# EAGLE design IdcProbe (EAGLE 7.1.0)

## Sheet 1 of 2: Power
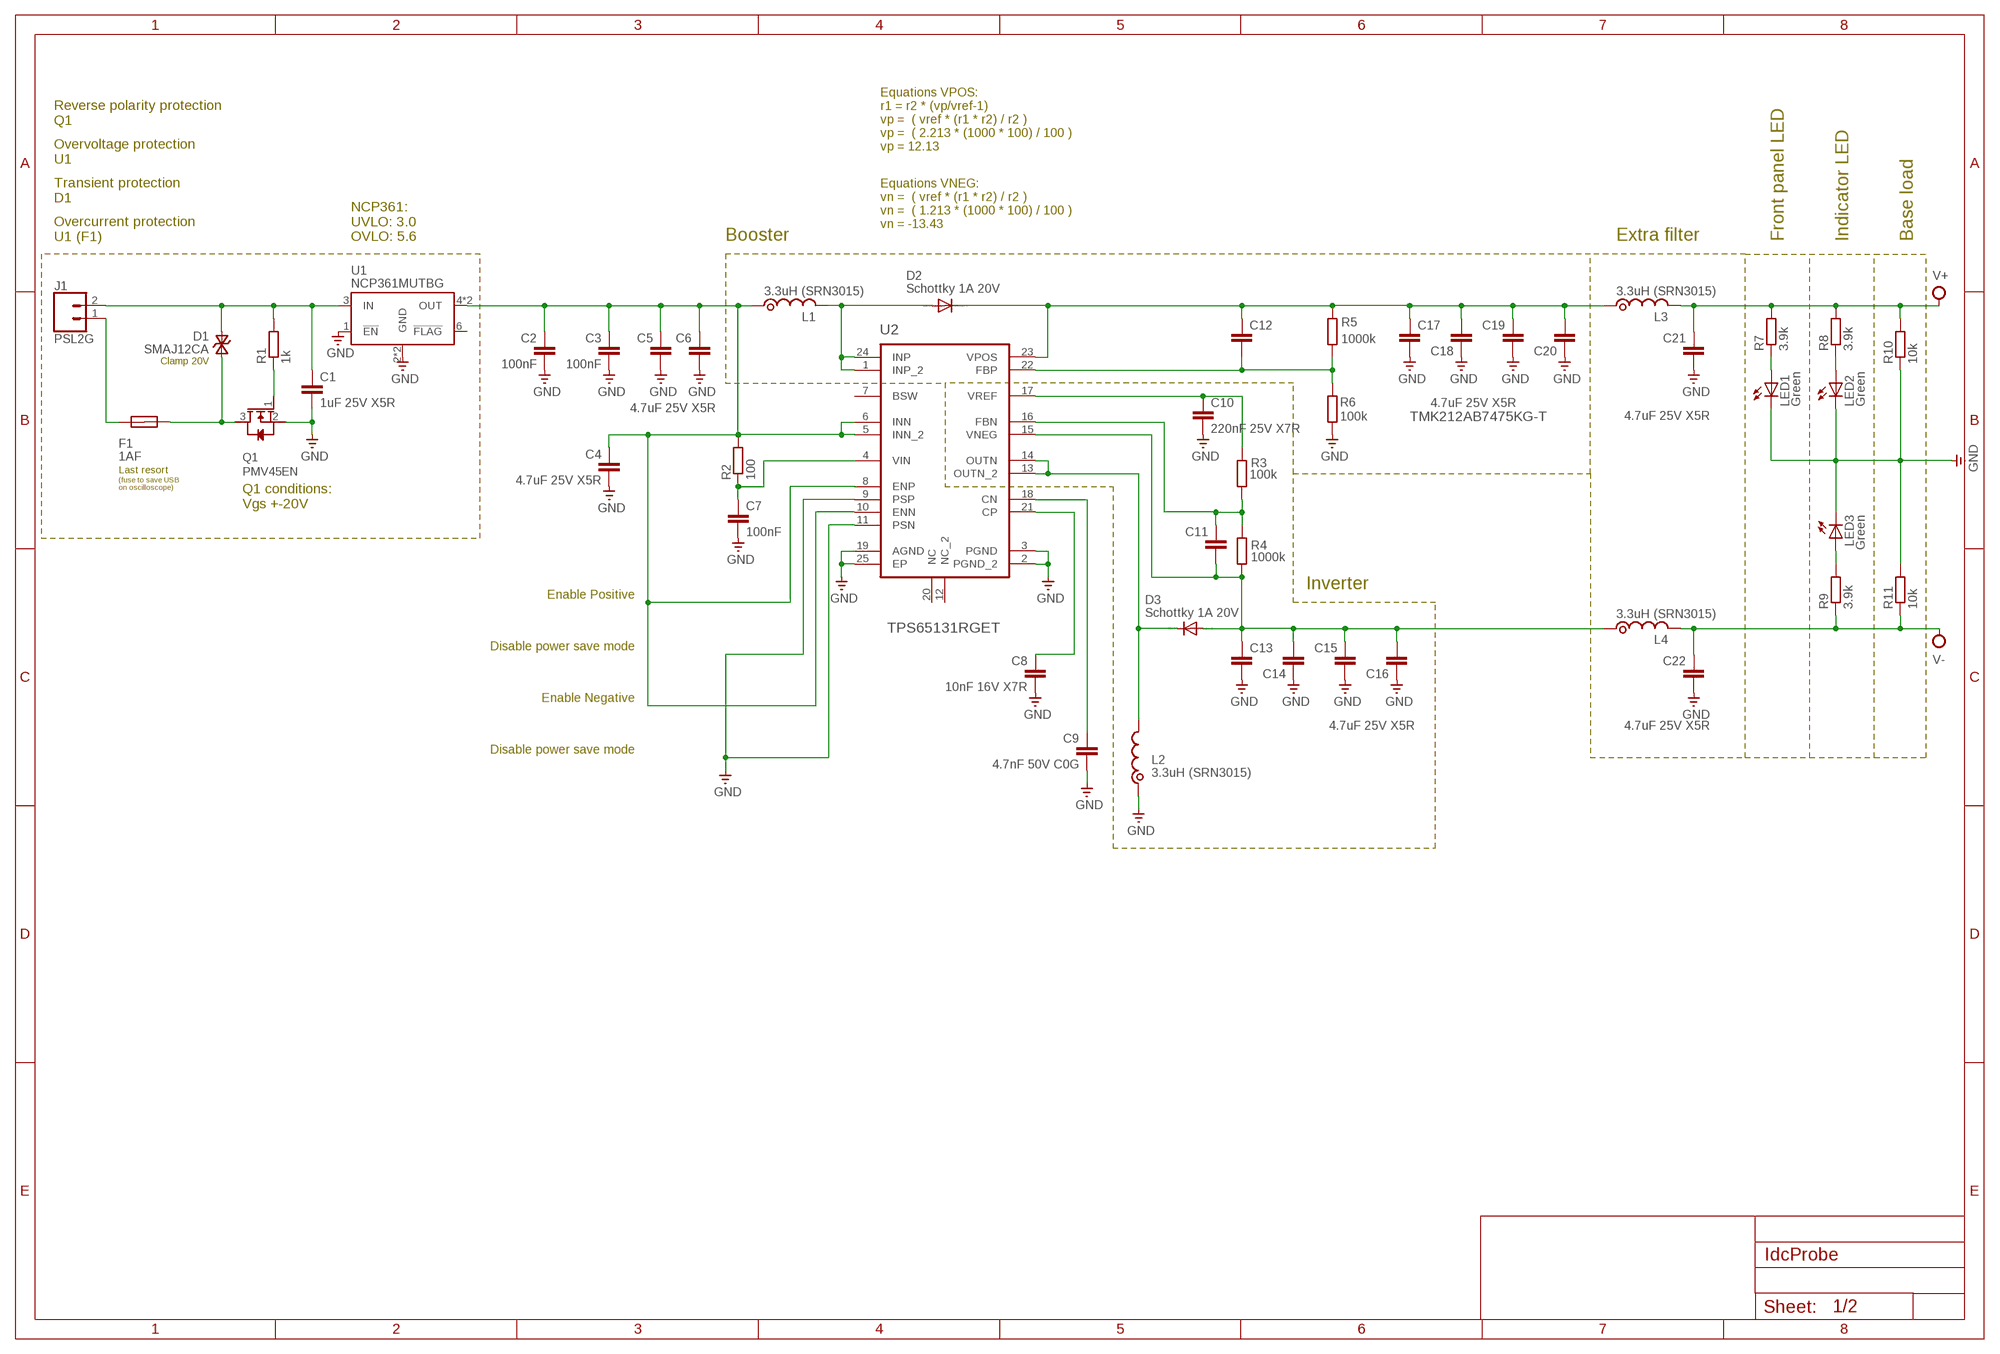
[diagram p0: schematic, sheet 1]

### Parts
C1  1uF 25V X5R  C-EUC0805  [C0805]
C2  100nF  C-EUC0805  [C0805]
C3  100nF  C-EUC0805  [C0805]
C4  4.7uF 25V X5R  C-EUC0805  [C0805]
C5  4.7uF 25V X5R  C-EUC0805  [C0805]
C6  4.7uF 25V X5R  C-EUC0805  [C0805]
C7  100nF  C-EUC0805  [C0805]
C8  10nF 16V X7R  C-EUC0805  [C0805]
C9  4.7nF 50V C0G  C-EUC0805  [C0805]
C10  220nF 25V X7R  C-EUC0805  [C0805]
C11  C-EUC0805  [C0805]
C12  C-EUC0805  [C0805]
C13  4.7uF 25V X5R  C-EUC0805  [C0805]
C14  4.7uF 25V X5R  C-EUC0805  [C0805]
C15  4.7uF 25V X5R  C-EUC0805  [C0805]
C16  4.7uF 25V X5R  C-EUC0805  [C0805]
C17  4.7uF 25V X5R  C-EUC0805  [C0805]
C18  4.7uF 25V X5R  C-EUC0805  [C0805]
C19  4.7uF 25V X5R  C-EUC0805  [C0805]
C20  4.7uF 25V X5R  C-EUC0805  [C0805]
C21  4.7uF 25V X5R  C-EUC0805  [C0805]
C22  4.7uF 25V X5R  C-EUC0805  [C0805]
D1  SMAJ12CA  TVS_BISMA  [SMA_NOPOL]
D2  Schottky 1A 20V  DIODE-SOD323-R  [SOD323-R]
D3  Schottky 1A 20V  DIODE-SOD323-R  [SOD323-R]
F1  1AF  FUSE1206  [1206_HV]
J1  PSL2G  CONN_02POLAR  [MOLEX-1X2]
L1  3.3uH (SRN3015)  INDUCTOR_VLS3015  [VLS3015]
L2  3.3uH (SRN3015)  INDUCTOR_VLS3015  [VLS3015]
L3  3.3uH (SRN3015)  INDUCTOR_VLS3015  [VLS3015]
L4  3.3uH (SRN3015)  INDUCTOR_VLS3015  [VLS3015]
LED1  Green  LED3MM  [LED3MM]
LED2  Green  LEDCHIP-LED0805  [CHIP-LED0805]
LED3  Green  LEDCHIP-LED0805  [CHIP-LED0805]
Q1  PMV45EN  [SOT23]
R1  1k  R-EU_R0805I  [R0805I]
R2  100  R-EU_R0805I  [R0805I]
R3  100k  R-EU_R0805I  [R0805I]
R4  1000k  R-EU_R0805I  [R0805I]
R5  1000k  R-EU_R0805I  [R0805I]
R6  100k  R-EU_R0805I  [R0805I]
R7  3.9k  R-EU_R0805I  [R0805I]
R8  3.9k  R-EU_R0805I  [R0805I]
R9  3.9k  R-EU_R0805I  [R0805I]
R10  10k  R-EU_R0805I  [R0805I]
R11  10k  R-EU_R0805I  [R0805I]
U1  NCP361MUTBG  NCP36XMU  [UDFN6_2X2]
U2  TPS65131RGET  [QFN50P400X400X100-25N]

### Nets
CN: C9.1 U2.18(CN)
CP: C8.1 U2.21(CP)
FBN: C11.1 R3.1 R4.1 U2.16(FBN)
FBP: C12.2 R5.1 R6.2 U2.22(FBP)
GND: C1.2 C2.2 C3.2 C4.2 C5.2 C6.2 C7.2 C8.2 C9.2 C10.2 C13.2 C14.2 C15.2 C16.2 C17.2 C18.2 C19.2 C20.2 C21.2 C22.2 L2.1 LED1.K(C) LED2.C LED3.C Q1.2(S) R6.1 R10.1 R11.2 U1.1(!EN) U1.2(GND) U1.7(GND) U2.2(PGND_2) U2.3(PGND) U2.9(PSP) U2.11(PSN) U2.19(AGND) U2.25(EP) ; also sheet 2
INP: D2.A L1.2 U2.1(INP_2) U2.24(INP)
N$1: LED2.A R8.1
N$2: LED3.A R9.2
N$16: LED1.A R7.1
N$17: C1.1 D1.2(C) J1.2 R1.2 U1.3(IN)
N$18: D1.1(A) F1.P$1 Q1.3(D)
N$19: Q1.1(G) R1.1
N$21: F1.P$2 J1.1
OUTN: D3.C L2.2 U2.13(OUTN_2) U2.14(OUTN)
RV+: C12.1 C17.1 C18.1 C19.1 C20.1 D2.C L3.1 R5.2 U2.23(VPOS)
RV-: C11.2 C13.1 C14.1 C15.1 C16.1 D3.A L4.1 R4.2 U2.15(VNEG)
V+: C21.1 L3.2 R7.2 R8.2 R10.2 ; also sheet 2
V-: C22.1 L4.2 R9.1 R11.1 ; also sheet 2
VI: C2.1 C3.1 C4.1 C5.1 C6.1 L1.1 R2.2 U1.4(OUT) U1.5(OUT) U2.5(INN_2) U2.6(INN) U2.8(ENP) U2.10(ENN)
VIN: C7.1 R2.1 U2.4(VIN)
VREF: C10.1 R3.2 U2.17(VREF)
Unconnected: U1.6(!FLAG) U2.7(BSW) U2.12(NC_2) U2.20(NC)

### Notes on the sheet
- Reverse polarity protection
  Q1
- Equations VPOS:
  r1 = r2 * (vp/vref-1)
  vp =  ( vref * (r1 * r2) / r2 )
  vp =  ( 2.213 * (1000 * 100) / 100 )
  vp = 12.13
- Overvoltage protection
  U1
- Transient protection
  D1
- Equations VNEG:
  vn =  ( vref * (r1 * r2) / r2 )
  vn =  ( 1.213 * (1000 * 100) / 100 )
  vn = -13.43
- Overcurrent protection
  U1 (F1)
- NCP361:
  UVLO: 3.0
  OVLO: 5.6
- Booster | Extra filter | Front panel LED | Indicator LED | Base load
- Clamp 20V
- Last resort
- (fuse to save USB 
  on oscilloscope)
- Q1 conditions:
  Vgs +-20V
- Enable Positive | Inverter
- Disable power save mode
- Enable Negative
- Disable power save mode

## Sheet 2 of 2: Measurement
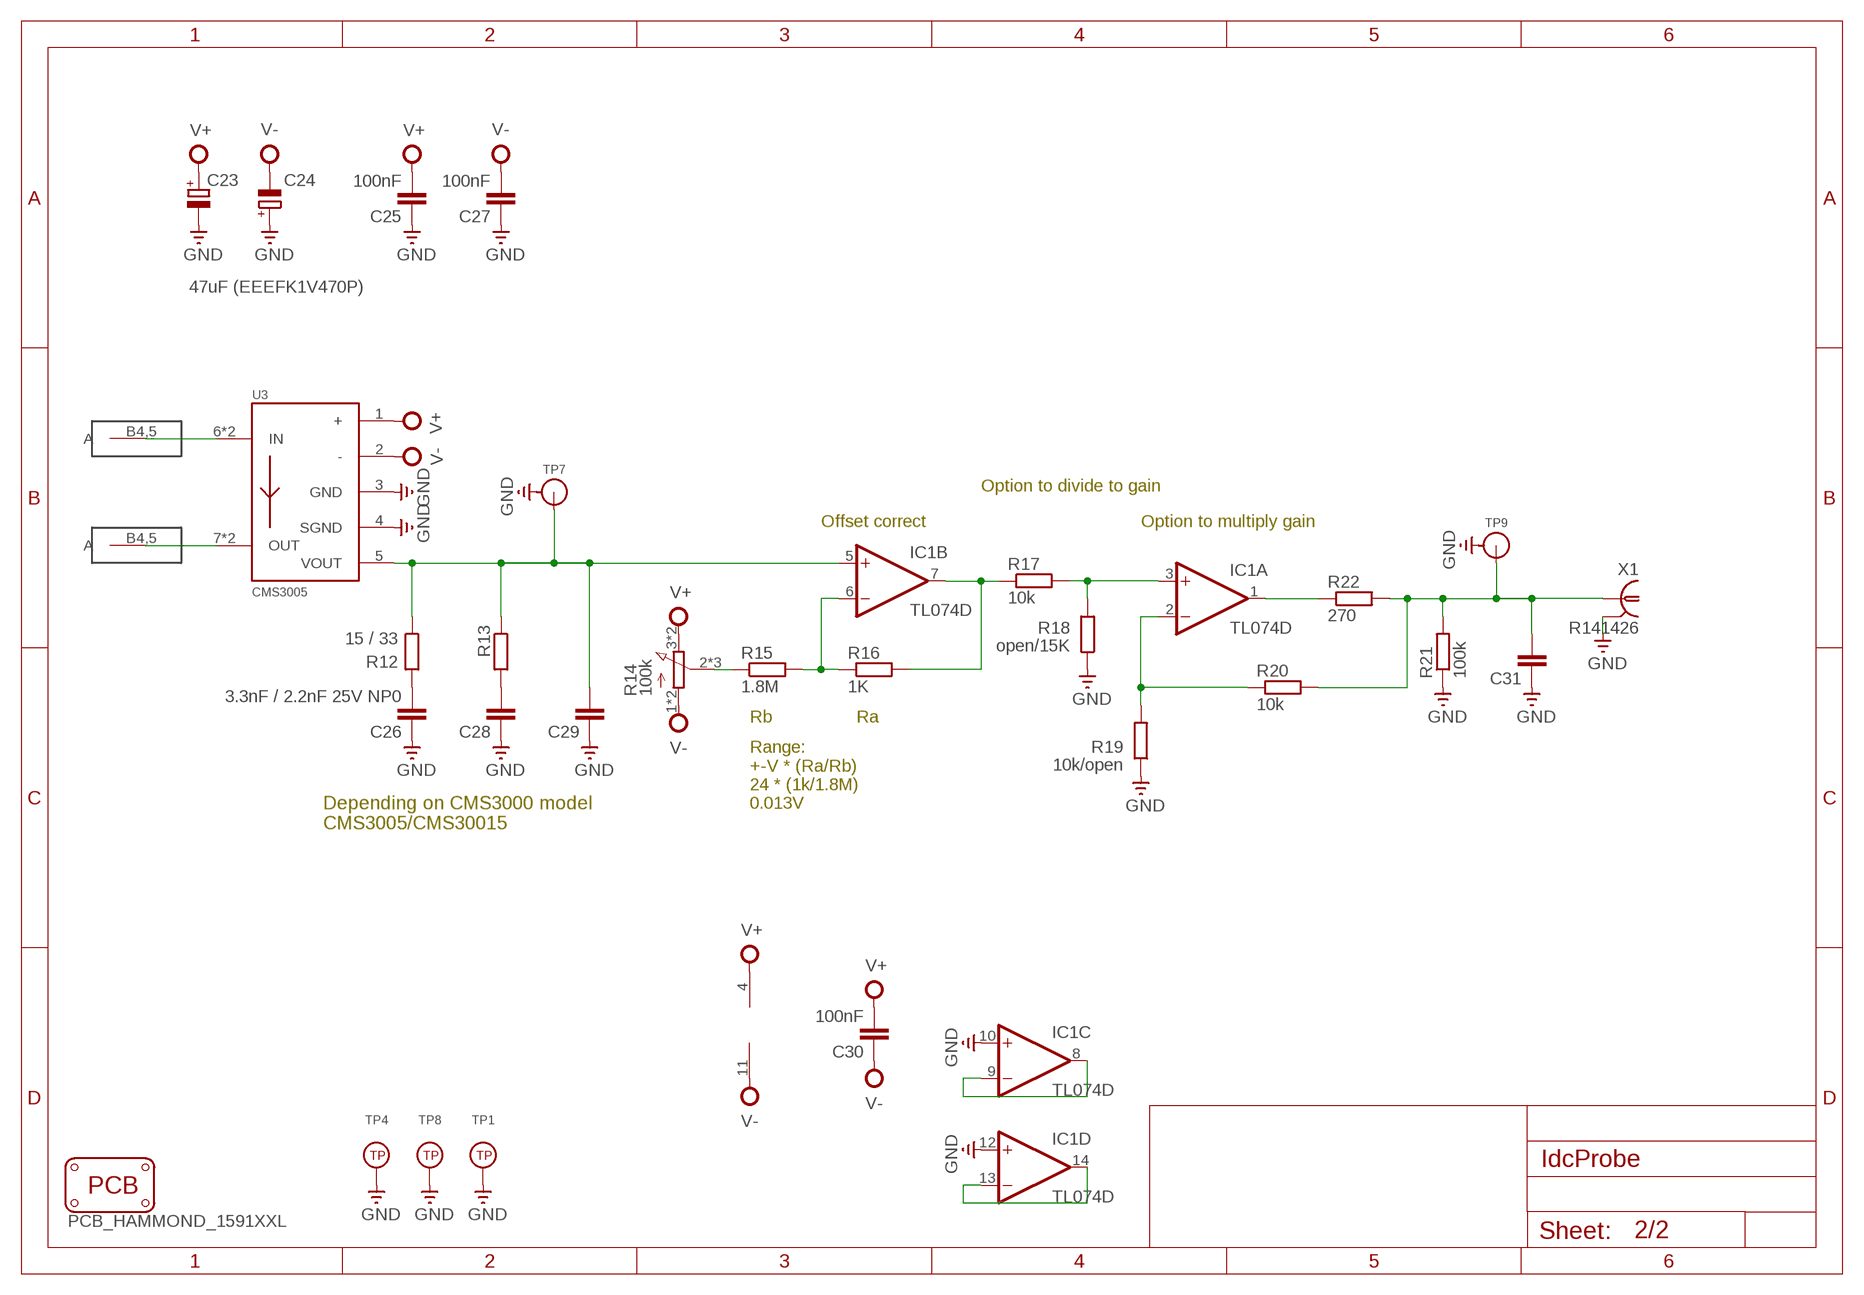
[diagram p1: schematic, sheet 2]

### Parts
C23  47uF (EEEFK1V470P)  CPOL-EUD  [PANASONIC_D]
C24  47uF (EEEFK1V470P)  CPOL-EUD  [PANASONIC_D]
C25  100nF  C-EUC0805  [C0805]
C26  3.3nF / 2.2nF 25V NP0  C-EUC0805  [C0805]
C27  100nF  C-EUC0805  [C0805]
C28  C-EUC0805  [C0805]
C29  C-EUC0805  [C0805]
C30  100nF  C-EUC0805  [C0805]
C31  C-EUC0805  [C0805]
H1  PCB_HAMMOND_1591XXL  [HMD_MFG_1591XXL]
IC1  TL074D  [SO14]
P1  BANANA_SOCKETVERTICAL  [4,5-PAD]
P2  BANANA_SOCKETVERTICAL  [4,5-PAD]
R12  15 / 33  R-EU_R0805  [R0805]
R13  R-EU_R0805  [R0805]
R14  100k  POT_MULTI  [3386-MULTI]
R15  1.8M  R-EU_R0805  [R0805]
R16  1K  R-EU_R0805  [R0805]
R17  10k  R-EU_R0805I  [R0805I]
R18  open/15K  R-EU_R0805I  [R0805I]
R19  10k/open  R-EU_R0805I  [R0805I]
R20  10k  R-EU_R0805I  [R0805I]
R21  100k  R-EU_R0805  [R0805]
R22  270  R-EU_R0805  [R0805]
TP1  TESTPOINT  [TESTHOOK]
TP4  TESTPOINT  [TESTHOOK]
TP7  TESTPOINT_GND  [PROBE_POINT]
TP8  TESTPOINT  [TESTHOOK]
TP9  TESTPOINT_GND  [PROBE_POINT]
U3  CMS3005  CMS3000_15A  [CMS3015]
X1  R141426  [R141426]

### Nets
GND: C23.- C24.+ C25.1 C26.1 C27.1 C28.1 C29.1 C31.1 IC1.10(C:+IN) IC1.12(D:+IN) R18.1 R19.1 R21.1 TP1.TP TP4.TP TP7.GND TP8.TP TP9.GND U3.3(GND) U3.4(SGND) X1.2 X1.3 X1.4 X1.5 ; also sheet 1
N$3: IC1.7(B:OUT) R16.2 R17.1
N$4: IC1.6(B:-IN) R15.2 R16.1
N$5: P1.B4,5(A) U3.6'(IN) U3.6(IN)
N$6: P2.B4,5(A) U3.7'(OUT) U3.7(OUT)
N$7: IC1.8(C:OUT) IC1.9(C:-IN)
N$8: IC1.13(D:-IN) IC1.14(D:OUT)
N$9: C26.2 R12.2
N$10: C28.2 R13.2
N$11: C31.2 R20.2 R21.2 R22.2 TP9.TP X1.1
N$13: C29.2 IC1.5(B:+IN) R12.1 R13.1 TP7.TP U3.5(VOUT)
N$14: IC1.2(A:-IN) R19.2 R20.1
N$15: R14.2(SW) R14.5(SW) R14.7(SW) R15.1
N$20: IC1.3(A:+IN) R17.2 R18.2
N$22: IC1.1(A:OUT) R22.1
V+: C23.+ C25.2 C30.2 IC1.4(P:V+) R14.3(CW) R14.6(CW) U3.1(+) ; also sheet 1
V-: C24.- C27.2 C30.1 IC1.11(P:V-) R14.1(CCW) R14.4(CCW) U3.2(-) ; also sheet 1

### Notes on the sheet
- Option to divide to gain
- Offset correct | Option to multiply gain
- Rb | Ra
- Range: 
  +-V * (Ra/Rb)
  24 * (1k/1.8M)
  0.013V
- Depending on CMS3000 model
  CMS3005/CMS30015

## Library data of the parts
C1 C4-C6 C13-C22 = rcl:C-EU: CAPACITOR, European symbol; MPN: TMK212AB7475KG-T
C2 C3 C7-C12 C25-C31 = rcl:C-EU: CAPACITOR, European symbol
C23 C24 = rcl:CPOL-EU: POLARIZED CAPACITOR, European symbol
D1 = Jeroen:TVS_BI: Collection of bidirectional TVS diodes
D2 D3 = diode:DIODE-: DIODE; MPN: PMEG4010BEA
F1 = Jeroen:FUSE
H1 = Jeroen:PCB_HAMMOND: Multiple PCB formats from Hammond MFG cases
IC1 = linear:TL074: OP AMP
J1 = SparkFun-Connectors:CONN_02: Multi connection point. Often used as Generic Header-pin footprint for 0.1 inch spaced/style header connections On any of the 0.1 inch spaced packages, you can populate with these: Break Away Headers - Straight <https://www.sparkfun.com/products/116> (PRT-00116) Break Away Male Headers - Right Angle <https://www.sparkfun.com/products/553> (PRT-00553) Female Headers <https://www.sparkfun.com/products/115> (PRT-00115) Break Away Headers - Machine Pin <https://www.sparkfun.com/products/117> (PRT-00117) Break Away Female Headers - Swiss Machine Pin <https://www.sparkfun.com/products/743> (PRT-00743) For SCREWTERMINALS and SPRING TERMINALS visit here: Screw Terimnals on SparkFun.com <https://www.sparkfun.com/search/results?term=Screw+Terminals> (5mm/3.5mm/2.54mm spacing) This device is also useful as a general connection point to wire up your design to another part of your project. Our various solder wires solder well into these plated through hole pads. Hook-Up Wire - Assortment (Stranded, 22 AWG) <https://www.sparkfun.com/products/11375> (PRT-11375) Hook-Up Wire - Assortment (Solid Core, 22 AWG) <https://www.sparkfun.com/products/11367> (PRT-11367) View the entire wire category on our website here <https://www.sparkfun.com/categories/141> Special notes: Molex polarized connector foot print use with: PRT-08233 with associated crimp pins and housings. 2.54_SCREWTERM for use with PRT-10571. 3.5mm Screw Terminal footprints for PRT-08084 5mm Screw Terminal footprints for use with PRT-08432; SF_ID: PRT-09918
L1-L4 = Jeroen:INDUCTOR_: Collection of SMD Inductors
LED1-LED3 = led:LED: LED OSRAM: - CHIPLED LG R971, LG N971, LY N971, LG Q971, LY Q971, LO R971, LY R971 LH N974, LH R974 LS Q976, LO Q976, LY Q976 LO Q996 - Hyper CHIPLED LW Q18S LB Q993, LB Q99A, LB R99A - SideLED LS A670, LO A670, LY A670, LG A670, LP A670 LB A673, LV A673, LT A673, LW A673 LH A674 LY A675 LS A676, LA A676, LO A676, LY A676, LW A676 LS A679, LY A679, LG A679 - Hyper Micro SIDELED® LS Y876, LA Y876, LO Y876, LY Y876 LT Y87S - SmartLED LW L88C, LW L88S LB L89C, LB L89S, LG L890 LS L89K, LO L89K, LY L89K LS L896, LA L896, LO L896, LY L896 - TOPLED LS T670, LO T670, LY T670, LG T670, LP T670 LSG T670, LSP T670, LSY T670, LOP T670, LYG T670 LG T671, LOG T671, LSG T671 LB T673, LV T673, LT T673, LW T673 LH T674 LS T676, LA T676, LO T676, LY T676, LB T676, LH T676, LSB T676, LW T676 LB T67C, LV T67C, LT T67C, LS T67K, LO T67K, LY T67K, LW E67C LS E67B, LA E67B, LO E67B, LY E67B, LB E67C, LV E67C, LT E67C LW T67C LS T679, LY T679, LG T679 LS T770, LO T770, LY T770, LG T770, LP T770 LB T773, LV T773, LT T773, LW T773 LH T774 LS E675, LA E675, LY E675, LS T675 LS T776, LA T776, LO T776, LY T776, LB T776 LHGB T686 LT T68C, LB T68C - Hyper Mini TOPLED® LB M676 - Mini TOPLED Santana® LG M470 LS M47K, LO M47K, LY M47K Source: http://www.osram.convergy.de LUXEON: - LUMILED® LXK2-PW12-R00, LXK2-PW12-S00, LXK2-PW14-U00, LXK2-PW14-V00 LXK2-PM12-R00, LXK2-PM12-S00, LXK2-PM14-U00 LXK2-PE12-Q00, LXK2-PE12-R00, LXK2-PE12-S00, LXK2-PE14-T00, LXK2-PE14-U00 LXK2-PB12-K00, LXK2-PB12-L00, LXK2-PB12-M00, LXK2-PB14-N00, LXK2-PB14-P00, LXK2-PB14-Q00 LXK2-PR12-L00, LXK2-PR12-M00, LXK2-PR14-Q00, LXK2-PR14-R00 LXK2-PD12-Q00, LXK2-PD12-R00, LXK2-PD12-S00 LXK2-PH12-R00, LXK2-PH12-S00 LXK2-PL12-P00, LXK2-PL12-Q00, LXK2-PL12-R00 Source: www.luxeon.com KINGBRIGHT: KA-3528ASYC Source: www.kingbright.com
P1 P2 = Jeroen:BANANA_SOCKET: 4 mm banana plug socket .6" spacing
Q1 = Jeroen:PMV45EN: PMV45EN Logic Level Trenchmos
R1-R13 R15-R22 = rcl:R-EU_: RESISTOR, European symbol
R14 = Jeroen:POT_MULTI: 3/8 multi pot; MPN: 3386P-1-104LF
TP1 TP4 TP8 = Jeroen:TESTPOINT
TP7 TP9 = Jeroen:TESTPOINT_GND
U1 = Jeroen:NCP36X; MPN: TMK212AB7475KG-T
U2 = Jeroen:TPS65131RGET: POSITIVE AND NEGATIVE OUTPUT DC-DC CONVERTER; MPN: TPS65131RGET; OC_FARNELL: 1755480; OC_NEWARK: 44J2536; PACKAGE: VQFN-24; SUPPLIER: Texas Instruments
U3 = Jeroen:CMS3000: CMS3005 Highly Dynamic MagnetoResistive Current Sensor (IPN = 5 A)
X1 = con-coax:R141426: BNC COAX CONNECTOR Radiall 50/75 Ohm Spoerle; MF: FARNELL; MPN: R141426161; OC_FARNELL: 4195115; OC_NEWARK: 14J7919

## Net classes
1 power: width 0.254 mm

## Board
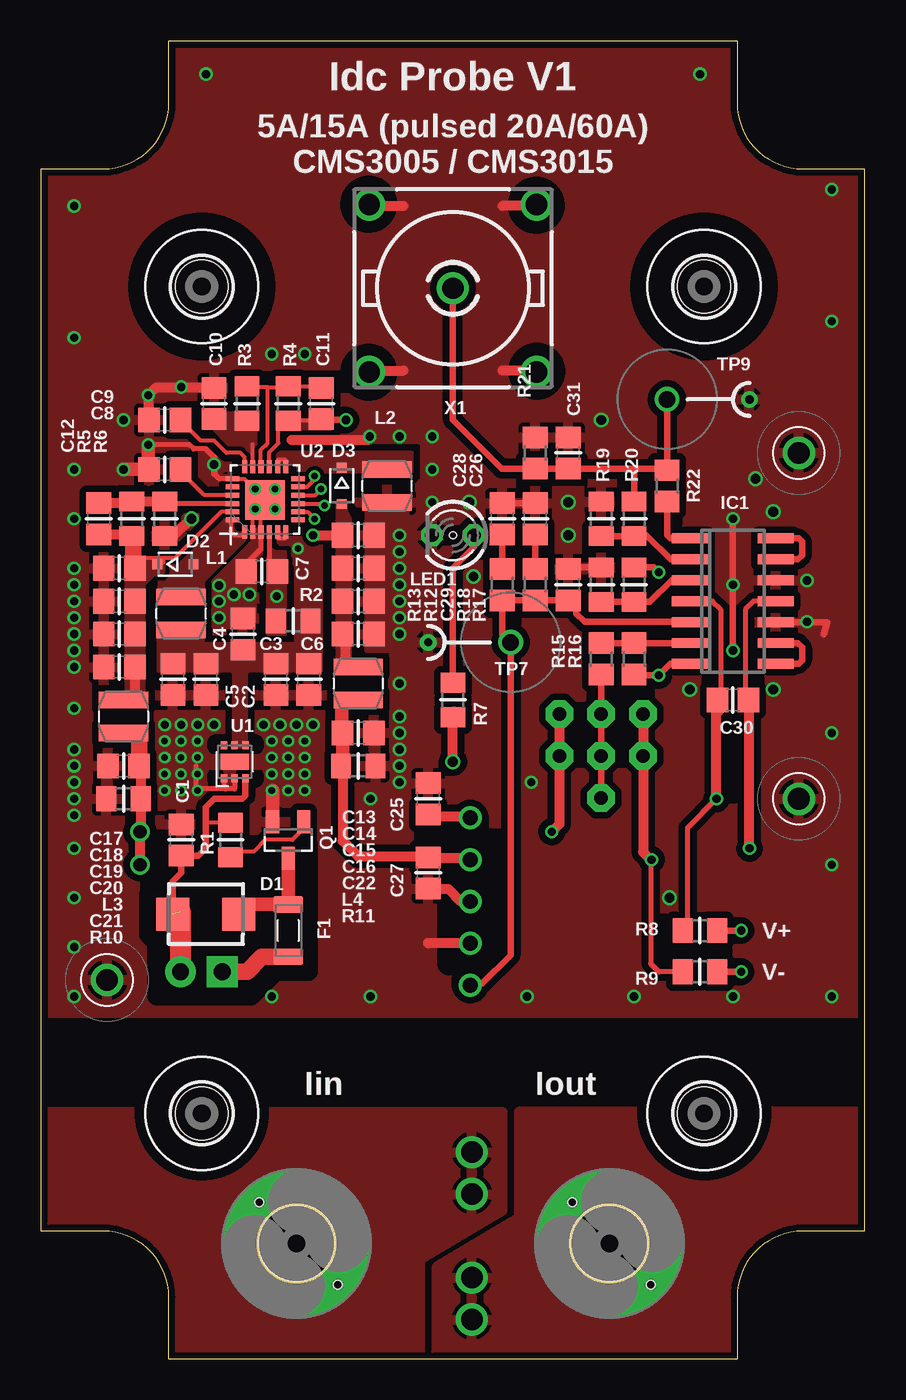
[diagram p2: board, top side]
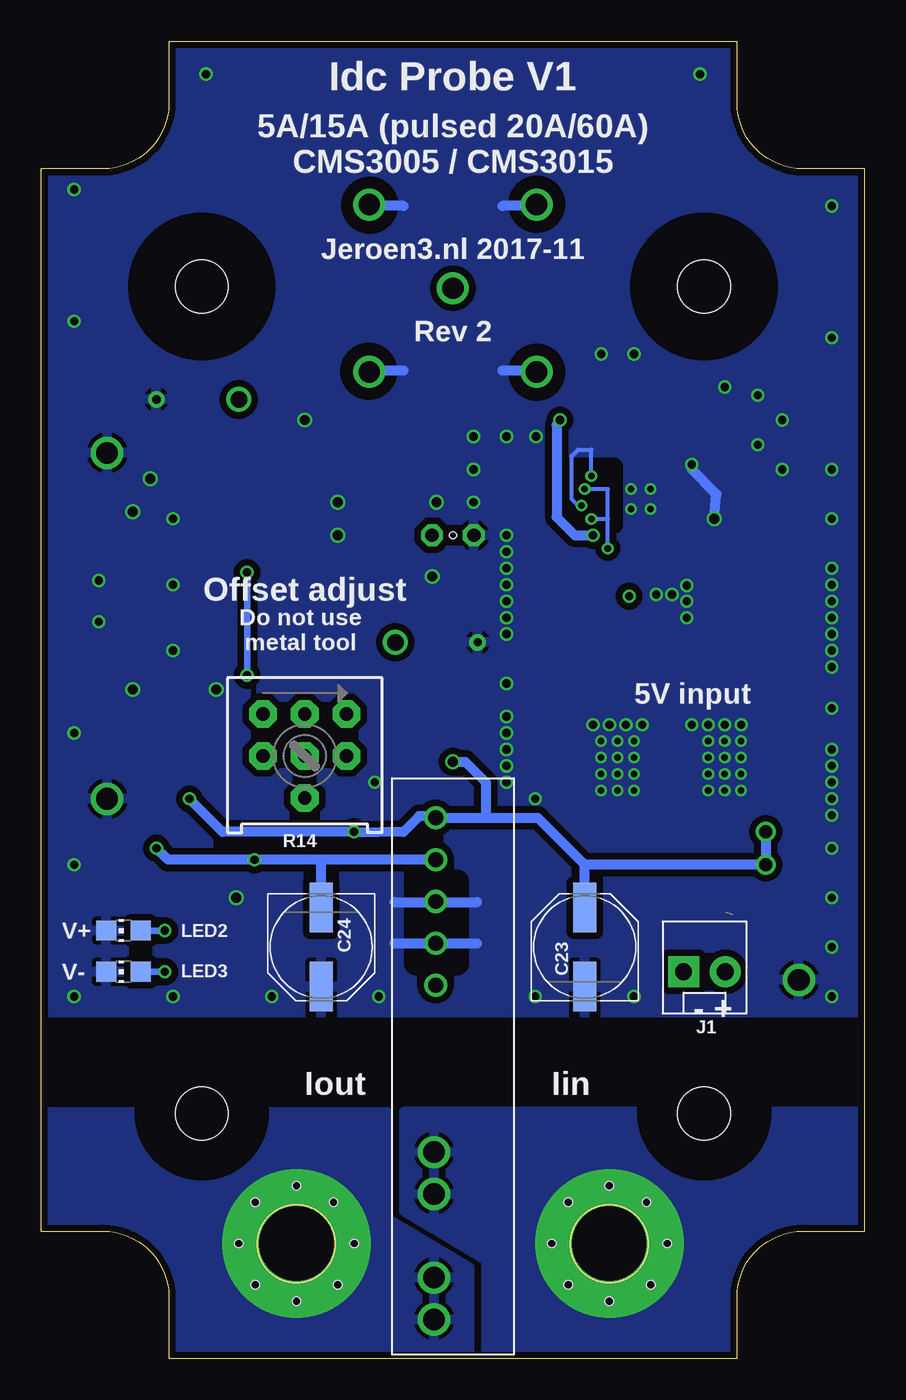
[diagram p3: board, bottom side, seen from below]

Size 50 x 80 mm. Coordinates in mm from the lower left corner, seen from the top.
Copper layers (1*16): Top 0.035mm / dielectric 1.5mm / Bottom 0.035mm
Design rules "Smart Prototyping 2 layer 2016-06-12": minimum track width 6mil, minimum drill 0.3mm, track to track 6mil, track to pad 6mil, pad to pad 6mil, via to via 6mil, smd to smd 0mil, copper to edge 0.4mm, drill to drill 10mil, minimum pad ring 10mil, minimum via ring 6mil, stop-mask expansion 2mil, vias tented up to drill 25mil, thermal gap 10mil
Holes 0.4 mm at 25,50
tRestrict: area 18.7,58.7 to 21.1,61.1; area 18.7,68.9 to 21.1,71.3; area 28.9,68.8 to 31.2,71.2; area 28.9,58.8 to 31.3,61.2; area 12,50.5 to 15.2,54; 23 lines
bRestrict: area 18.7,58.7 to 21.1,61.1; area 28.9,58.8 to 31.3,61.2; area 18.7,68.9 to 21.1,71.3; area 28.9,68.8 to 31.2,71.2; 12 lines

### Footprints (pad centres in the part's own frame; a part is rotated, then mirrored left to right if it is on the bottom)
C0805 = smd 1.3 x 1.5: 1 -0.95,0; 2 0.95,0
PANASONIC_D = smd 3 x 1.4: + 2.4,0; - -2.4,0
SMA_NOPOL = smd 2 x 2: 1 -2,0; 2 2,0
SOD323-R = smd 0.6 x 0.6: A 1.1,0; C -1.1,0
1206_HV = smd 1 x 1.75: P$1 -1.587,0; P$2 1.587,0
HMD_MFG_1591XXL = hole 3.2: 9.75,65.1; 40.25,65.1; 9.75,14.9; 40.25,14.9
SO14 = smd 0.6 x 2.2: 1 -3.81,-2.6; 2 -2.54,-2.6; 3 -1.27,-2.6; 4 0,-2.6; 5 1.27,-2.6; 6 2.54,-2.6; 7 3.81,-2.6; 8 3.81,2.6; 9 2.54,2.6; 10 1.27,2.6; 11 0,2.6; 12 -1.27,2.6; 13 -2.54,2.6; 14 -3.81,2.6
MOLEX-1X2 = drill 1.016 pad 1.88 square: 1 0,0 | drill 1.016 pad 1.88: 2 2.54,0
VLS3015 = smd 1 x 3: 1 -1,0; 2 1,0
LED3MM = drill 0.813 octagon: A -1.27,0; K 1.27,0
CHIP-LED0805 = smd 1.2 x 1.2: A 0,-1.05; C 0,1.05
4,5-PAD = drill 4.5 pad 9: B4,5 0,0 | hole 0.5: -3.5,0; 0,-3.5; 3.5,0; 0,3.5; -2.25,2.5; 2.5,2.5; 2.5,-2.5; -2.5,-2.5
SOT23 = smd 0.8 x 1.4: 1 -0.95,-1.1; 2 0.95,-1.1; 3 0,1.1
R0805I = smd 1.2 x 1.5: 1 -1.05,0; 2 1.05,0
R0805 = smd 1.3 x 1.5: 1 -0.95,0; 2 0.95,0
3386-MULTI = drill 0.813 pad 1.676 octagon: 1 -2.54,0; 2 0,-2.54; 3 2.54,0; 4 -2.54,2.54; 5 0,2.54; 6 2.54,2.54; 7 0,0
TESTHOOK = drill 1.32: TP 0,0
PROBE_POINT = drill 0.5: GND -5,0 | drill 1: TP 0,0
UDFN6_2X2 = smd 0.47 x 0.4: 1 -1,0.65; 2 -1,0; 3 -1,-0.65; 4 1,-0.65; 5 1,0; 6 1,0.65 | smd 0.95 x 1.7: 7 0,0
QFN50P400X400X100-25N = smd 0.813 x 0.305: 1 -1.981,1.245; 2 -1.981,0.762; 3 -1.981,0.254; 4 -1.981,-0.254; 5 -1.981,-0.762; 6 -1.981,-1.245; 13 1.981,-1.245; 14 1.981,-0.762; 15 1.981,-0.254; 16 1.981,0.254; 17 1.981,0.762; 18 1.981,1.245 | smd 0.305 x 0.813: 7 -1.245,-1.981; 8 -0.762,-1.981; 9 -0.254,-1.981; 10 0.254,-1.981; 11 0.762,-1.981; 12 1.245,-1.981; 19 1.245,1.981; 20 0.762,1.981; 21 0.254,1.981; 22 -0.254,1.981; 23 -0.762,1.981; 24 -1.245,1.981 | smd 2.4 x 2.4: 25 -0.025,0
CMS3015 = drill 0.9: 1 15.095,1.05; 2 12.555,1.05; 3 10.015,1.05; 4 7.475,1.05; 5 4.935,1.05 | drill 1.3: 6 -7.745,1.15; 6' -5.205,1.15; 7 -15.365,1.15; 7' -12.825,1.15
R141426 = drill 1.295: 1 0,0; 2 5.08,5.08; 3 -5.08,5.08; 4 -5.08,-5.08; 5 5.08,-5.08

### Placement (x,y rotation side)
C1  8.5,31.5 90 top
C2  10,41.25 270 top
C3  14.25,41.25 270 top
C4  12.25,44 90 top
C5  8,41.25 270 top
C6  16.25,41.25 270 top
C7  13.4,47.8 180 top
C8  7.5,54 180 top
C9  7.5,57 180 top
C10  10.5,58 90 top
C11  17,58 270 top
C12  3.5,51 90 top
C13  19.25,50 0 top
C14  19.25,48 0 top
C15  19.25,46 0 top
C16  19.25,44 0 top
C17  4.75,48 180 top
C18  4.75,46 180 top
C19  4.75,44 180 top
C20  4.75,42 180 top
C21  5,36 180 top
C22  19.25,38 0 top
C23  17,25 90 bottom
C24  33,25 270 bottom
C25  23.5,34 270 top
C26  30,51 270 top
C27  23.5,29.5 90 top
C28  28,51 270 top
C29  32,47 270 top
C30  42,40 180 top
C31  32,55 270 top
D1  10,27 180 top
D2  8.15,48.25 0 top
D3  18.25,53 270 top
F1  15,26 270 top
H1  0,0 0 top
IC1  42,46 270 top
J1  11,23.5 0 bottom
L1  8.5,45.25 90 top
L2  21,53 90 top
L3  5,39 270 top
L4  19.25,41 270 top
LED1  25,50 180 top
LED2  45,26 90 bottom
LED3  45,23.5 90 bottom
P1  15.5,7 0 top
P2  34.5,7 0 top
Q1  15,31.5 180 top
R1  11.5,31.5 90 top
R2  15.3,44.8 0 top
R3  12.5,58 270 top
R4  15,58 270 top
R5  5.5,51 270 top
R6  7.5,51 90 top
R7  25,40 270 top
R8  40,26 180 top
R9  40,23.5 0 top
R10  5,34 0 top
R11  19.25,36 0 top
R12  30,47 90 top
R13  28,47 90 top
R14  34,36.6 0 bottom
R15  34,42.5 90 top
R16  36,42.5 270 top
R17  36,47 270 top
R18  34,47 270 top
R19  34,51 270 top
R20  36,51 90 top
R21  30,55 270 top
R22  38,53 90 top
TP1  46,55 0 top
TP4  46,34 0 top
TP7  28.5,43.5 0 top
TP8  4,23 0 top
TP9  38,58.25 180 top
U1  11.75,36.25 90 top
U2  13.6,52.18 90 top
U3  25,17.75 90 bottom
X1  25,65 0 top

### Tracks (layer width: path | path; a pad name or v marks a point on that pad's centre or on a via)
CN
  Top 0.254: U2.18 12.36,54.74 12.1,55 11.25,55 10.5,55.75 9.7,55.75 C9.1
CP
  Top 0.254: U2.21 9.92,52.43 8.45,53.9 C8.1
FBN
  Top 0.254: U2.16 13.35,55.2 13.75,55.6 13.75,59 | C11.1 17,59.05 R4.1 14.95,59 13.75,59 | 13.75,59 12.55,59 R3.1
FBP
  Top 0.254: 4.9,51.95 R5.1
  Top 0.305: U2.22 7.62,51.93 R6.2
  Top 0.61: R6.2 R5.1 | 4.9,51.95 C12.2
GND  (via drill 0.4, 0.5, 0.6)
  Top 0.254: U2.19 12.33,53.42 U2.25 13.35,51.9 U2.3 | U2.2 12.85,51.9 | U2.11 16.14,52.94 16.6,53.4 v16.6,53.6 | U2.9 17.13,51.93 v17.2,51.8 | X1.3 20,70 | 30,70 X1.2 | X1.5 30,60 | 20,60 X1.4 | C26.1 29.85,51.95 29.8,52
  Top 0.305: v6.5,55.5 9,55.5 9.25,55.25 10,55.25 10.5,54.75 | U2.19 10.82,53.42 10.5,53.75 | U2.3 13.35,49.15 12.4,48.2 | U1.2 11.75,34.6 11.2,34.6 | 11.2,34.6 9.4,34.6 9.4,36 | U1.1 11.1,34.7 11.2,34.6
  Top 0.4: C28.1 C26.1
  Top 0.406: 10.5,53.75 10.5,54.75 | 6.55,55.55 v6.5,55.5 | 6.5,54.05 C8.2 | v42,43 v42,51 | R18.1 32.1,48.05 C29.1 | IC1.10 47.73,44.73 47.5,44 | 29.8,52.05 29.8,52 29.8,51.8 | R19.1 34,51.8
  Top 0.61: C9.2 6.5,57.05 v6.5,58.5 6.95,58.95 C10.2 | R6.1 7.95,49.95 v9.13,51 | U3.4 23.52,25.23 23.5,25.25 | U3.3 25.48,27.77 24.75,28.5 23.55,28.5 C27.1 | 20,70 22,70 | 30,70 28,70 | 30,60 28,60 | 20,60 22,60 | 15.2,55.8 19.8,55.8 20,56
  Top 0.813: 6.5,54.05 v6.5,55.5 | v5,54 C8.2 | Q1.2 14.05,34.5
  Bottom 0.254: v17.2,51.8 17.4,51.8 17.8,52.2 17.8,54.8 17.4,55.2 16.6,55.2 v16.6,53.6
  Bottom 0.61: v9.13,51 9,52.5 10.5,54 v10.5,54.3 | 23.52,25.23 U3.4 28.55,25.23 | 28.55,27.73 23.52,27.73 | 20,70 22,70 | 20,60 22,60 | 28,60 30,60 | 28,70 30,70
  other vias: 2,48 2,44 2,42 21.75,48 21.75,50 26,52 32,52 39.37,40.64 38.15,28 29.75,35 2,25 48,22 40,78 10,78 2,70 21.75,46 21.75,44 20,34 2,46 7.5,38.5 8.5,38.5 9.5,38.5 10.5,38.5 14.5,38.5 13.5,38.5 15.5,38.5 16.5,38.5 11.7,46.4 12.65,46.4 10.8,45 10.8,46 10.8,46.95 2,37 2,35 21.75,37 21.75,35 2,54 5,57 8.5,59 23.75,52 21.75,56 19.95,56 21.75,41 21.75,39 2,33 2,39.5 14,61 16,61 13,52.8 14.2,52.8 14.2,51.6 13,51.6 2,28 2,31 2,22 14,22 20,22 29.5,22 36,22 42,22 48,30 48,38 48,63 48,71 2,62 2,51 23.75,56 21.75,49 21.75,47 21.75,45 21.75,38 21.75,36 2,47 2,45 2,43 2,36 2,34 32,50 46.5,44.75 46.5,47.25 42,47 44.45,40.64 43.37,53.44 44.45,51.44 23.75,54 26.25,47.5 34,57 9.5,37.5 9.5,36.5 9.5,35.5 9.5,34.5 8.5,36.5 8.5,35.5 8.5,37.5 7.5,37.5 7.5,36.5 7.5,35.5 7.5,34.5 8.5,34.5 14,37.5 15,37.5 16,37.5 15,36.5 16,36.5 15,35.5 16,35.5 14,35.5 14,36.5 14,34.5 15,34.5 16,34.5
  pour Top (rank 3, no thermals): 12.8,50.4 12.8,49.6 10.45,47.2 10.45,44.45 12.5,44.45 12.5,44.5 13,45 13,48.4 13.35,48.8 13.35,50.4
  pour Bottom (isolate 0.406, rank 6): 50,84 -2,81 -2,21 52,21
  pour Top (isolate 0.254, no thermals): 19.75,52.25 19.75,43 22.25,43 22.25,52.25
  pour Top (isolate 0.406, rank 6): 50,81 -2,81 -2,21 50,21
  pour Bottom (isolate 0.406, no thermals): 11.2,54.4 11.2,49.8 16,49.8 16,54.4
  pour Top (no thermals): 9.6,36.6 14,36.6 14,35.85 9.6,35.85
INP
  Top 0.254: U2.24 11.62,50.87 11.5,50.75 11.5,50.25 11.75,50 12.16,50 U2.1
  pour Top (isolate 0.254, rank 2, no thermals): 11.88,50.95 11.88,50.45 12.32,50.45 12.35,49.75 9.8,47.2 9.8,46 7.2,46 7.2,48.2 7.4,48.4 8.6,48.4 11.2,50.95
N$1  (via drill 0.5)
  Top 0.4: R8.1 v42.5,26
  Bottom 0.4: LED2.A v42.5,26
N$2  (via drill 0.5)
  Top 0.4: R9.2 v42.5,23.5
  Bottom 0.4: LED3.A v42.5,23.5
N$3  (via drill 0.5)
  Top 0.406: R16.2 35.55,41.5 v37.5,41.5 38.19,42.19 IC1.7 | R17.1 37.2,48.05 v37.5,47.75
  Bottom 0.406: v37.5,47.75 v37.5,41.5
N$4
  Top 0.4: R15.2 R16.1
  Top 0.406: IC1.6 R16.1
N$5
  pour Top: 22,0 22,15 28,15 28,9 23,6 23,0
  pour Bottom: 22,0 22,15 28,15 28,9 23,6 23,0
  pour Top (no thermals): 0,0 0,15 23,15 23,0
  pour Bottom (no thermals): 0,0 0,15 23,15 23,0
N$6
  pour Bottom (rank 2): 24,5.55 24,0 30,0 30,15 29,15 29,8.55
  pour Top (rank 2): 24,5.55 24,0 30,0 30,15 29,15 29,8.55
  pour Top (rank 2, no thermals): 29,15 29,0 50,0 50,15
  pour Bottom (rank 2, no thermals): 29,15 29,0 50,0 50,15
N$7
  Top 0.406: IC1.9 45.94,43.46 46.2,43.2 46.2,42.4 45.99,42.19 IC1.8
N$8
  Top 0.406: IC1.14 45.99,49.81 46.2,49.6 46.2,48.8 45.94,48.54 IC1.13
N$9
  Top 0.4: R12.2 C26.2
N$10
  Top 0.4: R13.2 C28.2
N$11
  Top 0.4: R20.2 36,52
  Top 0.406: R22.2 37.85,53.95 | X1.1 25,57 27.95,54.05 R21.2 C31.2 36,54.05 | 36,54.05 37.9,54.05 R22.2 | R20.2 36,54.05 | R22.2 TP9.TP
N$13
  Top 0.4: 32.32,45.73 C29.2 R12.1 R13.1 28,44 TP7.TP 28.5,24.5 26.79,22.79 26.16,22.79 U3.5
  Top 0.406: IC1.5 39.38,44.75 33,44.75 32.5,45.25 32.5,45.55 C29.2
N$14
  Top 0.4: R20.1 R19.2
  Top 0.406: IC1.2 38.21,48.54 36.75,50 36.05,50 R20.1
N$15
  Top 0.4: R14.2 R14.7 R14.5 R15.1
N$16
  Top 0.3: 26.27,49.27 LED1.A
  Top 0.406: 26.27,49.27 25,48 R7.1
N$17  (1 unrouted)
  Top 0.254: R1.2 10.05,32.55 10,32.5
  Top 0.406: U1.3 12.4,34.2 12.2,34 10.5,34 10,33.5 10,32.5 10,31 9.55,30.55 C1.1 8.5,29.5 8,29 D1.2
  Top 1.27: J1.2 8.46,27.14
N$18
  Top 0.813: Q1.3 F1.P$1 12,27.59 D1.1
N$19
  Top 0.254: Q1.1 15.95,32.2 15.25,31.5 13.6,31.5 12.9,30.8 11.85,30.8 R1.1
N$20
  Top 0.406: R18.2 R17.2 36.95,45.95 38.27,47.27 IC1.3
N$21
  Top 1.016: F1.P$2 13.4,24.4 12.5,23.5 J1.1
N$22
  Top 0.406: IC1.1 38.19,49.81 38,50 R22.1
OUTN
  Top 0.254: U2.14 14.36,54.51 14.45,54.6 | U2.13 14.85,54.55 14.8,54.6 14.4,54.6
  pour Top (isolate 0.254, no thermals): 14.35,55 14.35,53.9 22.5,53.9 22.5,55
RV+
  Top 0.254: U2.23 10.92,51.42 8.1,48.6 6.25,48.6 6.2,48.55 6.2,48.5 C17.1 | 7.4,48.6 7.4,48.35 D2.C
  Top 0.61: C12.1 5.4,50.05 R5.2 | L3.1 5.7,40 C20.1
  Top 1.016: R5.2 5.5,49.9 5.6,49.8 5.6,48.1 C17.1
  pour Top (no thermals): 5.2,39.8 5.2,48.6 7.4,48.6 7.4,47.8 7.2,47.6 6.8,47.6 6.2,47 6.2,39.8
RV-  (via drill 0.5)
  Top 0.254: U2.15 13.85,55.05 14.4,55.6 14.4,56.8 14.85,56.8 R4.2 17,56.95 C11.2
  Top 0.305: 17.1,57 C11.2
  Top 0.406: v18.5,57 17.1,57
  Top 0.61: v16.5,50 18.25,50 | L4.1 18.75,42 18.5,42.25 18.5,43.8 C16.1
  Bottom 0.61: v18.5,57 18.5,56.9 18.7,56.7 18.7,51.1 17.6,50 v16.5,50
  pour Top (no thermals): 18,52 18.5,52 18.5,51.5 18.75,51 18.75,41.75 18,41.75
  pour Top (isolate 0.254, rank 2, no thermals): 14.4,56.47 14.4,57 17.6,57 17.6,56.47
V+  (via drill 0.5, 0.6, 0.8)
  Top 0.3: R8.2 38.95,26.2 39.25,26.5 39.25,32.25 v41,34
  Top 0.305: IC1.4 40.75,46 41.25,45.5 41.25,39.2 C30.2
  Top 0.6: v41,34 41,39.95 C30.2 | R14.6 R14.3 31.46,32.46 v31,32 | 23.45,33 C25.2 | 24.1,32.95 25.95,32.95 U3.1
  Top 0.61: 24.1,32.95 C25.2 23.05,33.05 | 25.05,39.3 R7.2 v25,36.25 | C21.1 6.05,36 R10.2 6.05,32.05 v6,32 v6,30
  Top 1.016: C21.1 5.95,37.95 6,38 L3.2
  Bottom 0.6: 26.05,32.95 27.05,32.95 28,32 30.95,31.95 v31,32 39,32 v41,34
  Bottom 0.61: U3.1 23,32.84 | U3.1 26.05,32.95 | v25,36.25 24.25,36.25 23,35 23,32.84 | 25.89,33 U3.1 | v6,32 v6,30 17,30 | C23.+ 17,30 | 17,30 19.84,32.84 23,32.84
V-  (via drill 0.5)
  Top 0.3: R9.1 37.5,23.5 37,24 37,30.3 v37.05,30.3
  Top 0.305: IC1.11 43.25,46 42.75,45.5 42.75,40.2 C30.1
  Top 0.6: v43,31 43,39.95 C30.1 | R14.1 R14.4 36.54,30.77 37,30.3 | 24.04,30.41 25.95,30.41 U3.2
  Top 0.61: 24.04,30.41 C27.2 | 23.96,30.41 C27.2 | L4.2 18.25,40 | 18.3,36.1 18.3,31.45 19.25,30.5 23.45,30.5 C27.2
  Top 0.813: 18.25,40 18.25,38.05 C22.1 18.3,36.1 R11.1
  Bottom 0.3: v37.05,30.3 42.3,30.3 v43,31 | v37.05,30.3 37.05,30.25 37,30.2 | v37.05,30.3 37.01,30.3 36.95,30.35
  Bottom 0.6: 42.41,30.41 v43,31 42.3,30.3 33,30.3 U3.2
  Bottom 0.61: C24.- 33,30.3
VI  (via drill 0.4)
  Top 0.254: U2.10 16.63,52.43 v17,52.8 | U2.8 16.18,51.42 v16.6,51 | U2.5 14.36,49.84 14.4,49.8 14.8,49.8 14.85,49.84 U2.6
  Bottom 0.254: v15.6,49.2 15.6,51 | 15.6,51 15.6,52.8 v17,52.8 | v16.6,51 15.6,51
  pour Top (isolate 0.254, rank 4, no thermals): 7.1,44.6 7.1,41.8 11.6,41.8 11.7,41.65 11.7,37.15 12.45,37.15 12.45,41.65 12.6,41.8 17,41.8 17,49.8 14.85,49.85 14.85,50.4 14.4,50.4 14.4,49.6 15.45,48.15 15.45,43.4 9.8,43.4 9.8,44.6
VIN  (via drill 0.5)
  Top 0.305: U2.4 13.85,48.3 C7.1
  other vias: 14.3,46.3
  pour Top (rank 2, no thermals): 13.8,49.2 13.9,49.2 14.2,49 14.8,49 14.8,44 13.8,44
VREF
  Top 0.254: 10.5,56.75 C10.1 | U2.17 12.84,55.51
  Top 0.305: 12.4,57.05 R3.2
  pour Top (isolate 0.254, no thermals): 10,57.4 13,57.4 13,55 11.8,55 10.4,56.6 10,56.6

### Text on the board
tPlace: Idc Probe V1 | 5A/15A (pulsed 20A/60A) / CMS3005 / CMS3015 | V+ | V- | Iin | Iout
bPlace: Idc Probe V1 | 5A/15A (pulsed 20A/60A) / CMS3005 / CMS3015 | Jeroen3.nl 2017-11 | Rev 2 | Offset adjust | Do not use / metal tool | 5V input | V+ | V- | - + | Iin | Iout